# Altium schematic sheet Main.SchDoc
size A3; SheetNumber: 1; SheetTotal: 5
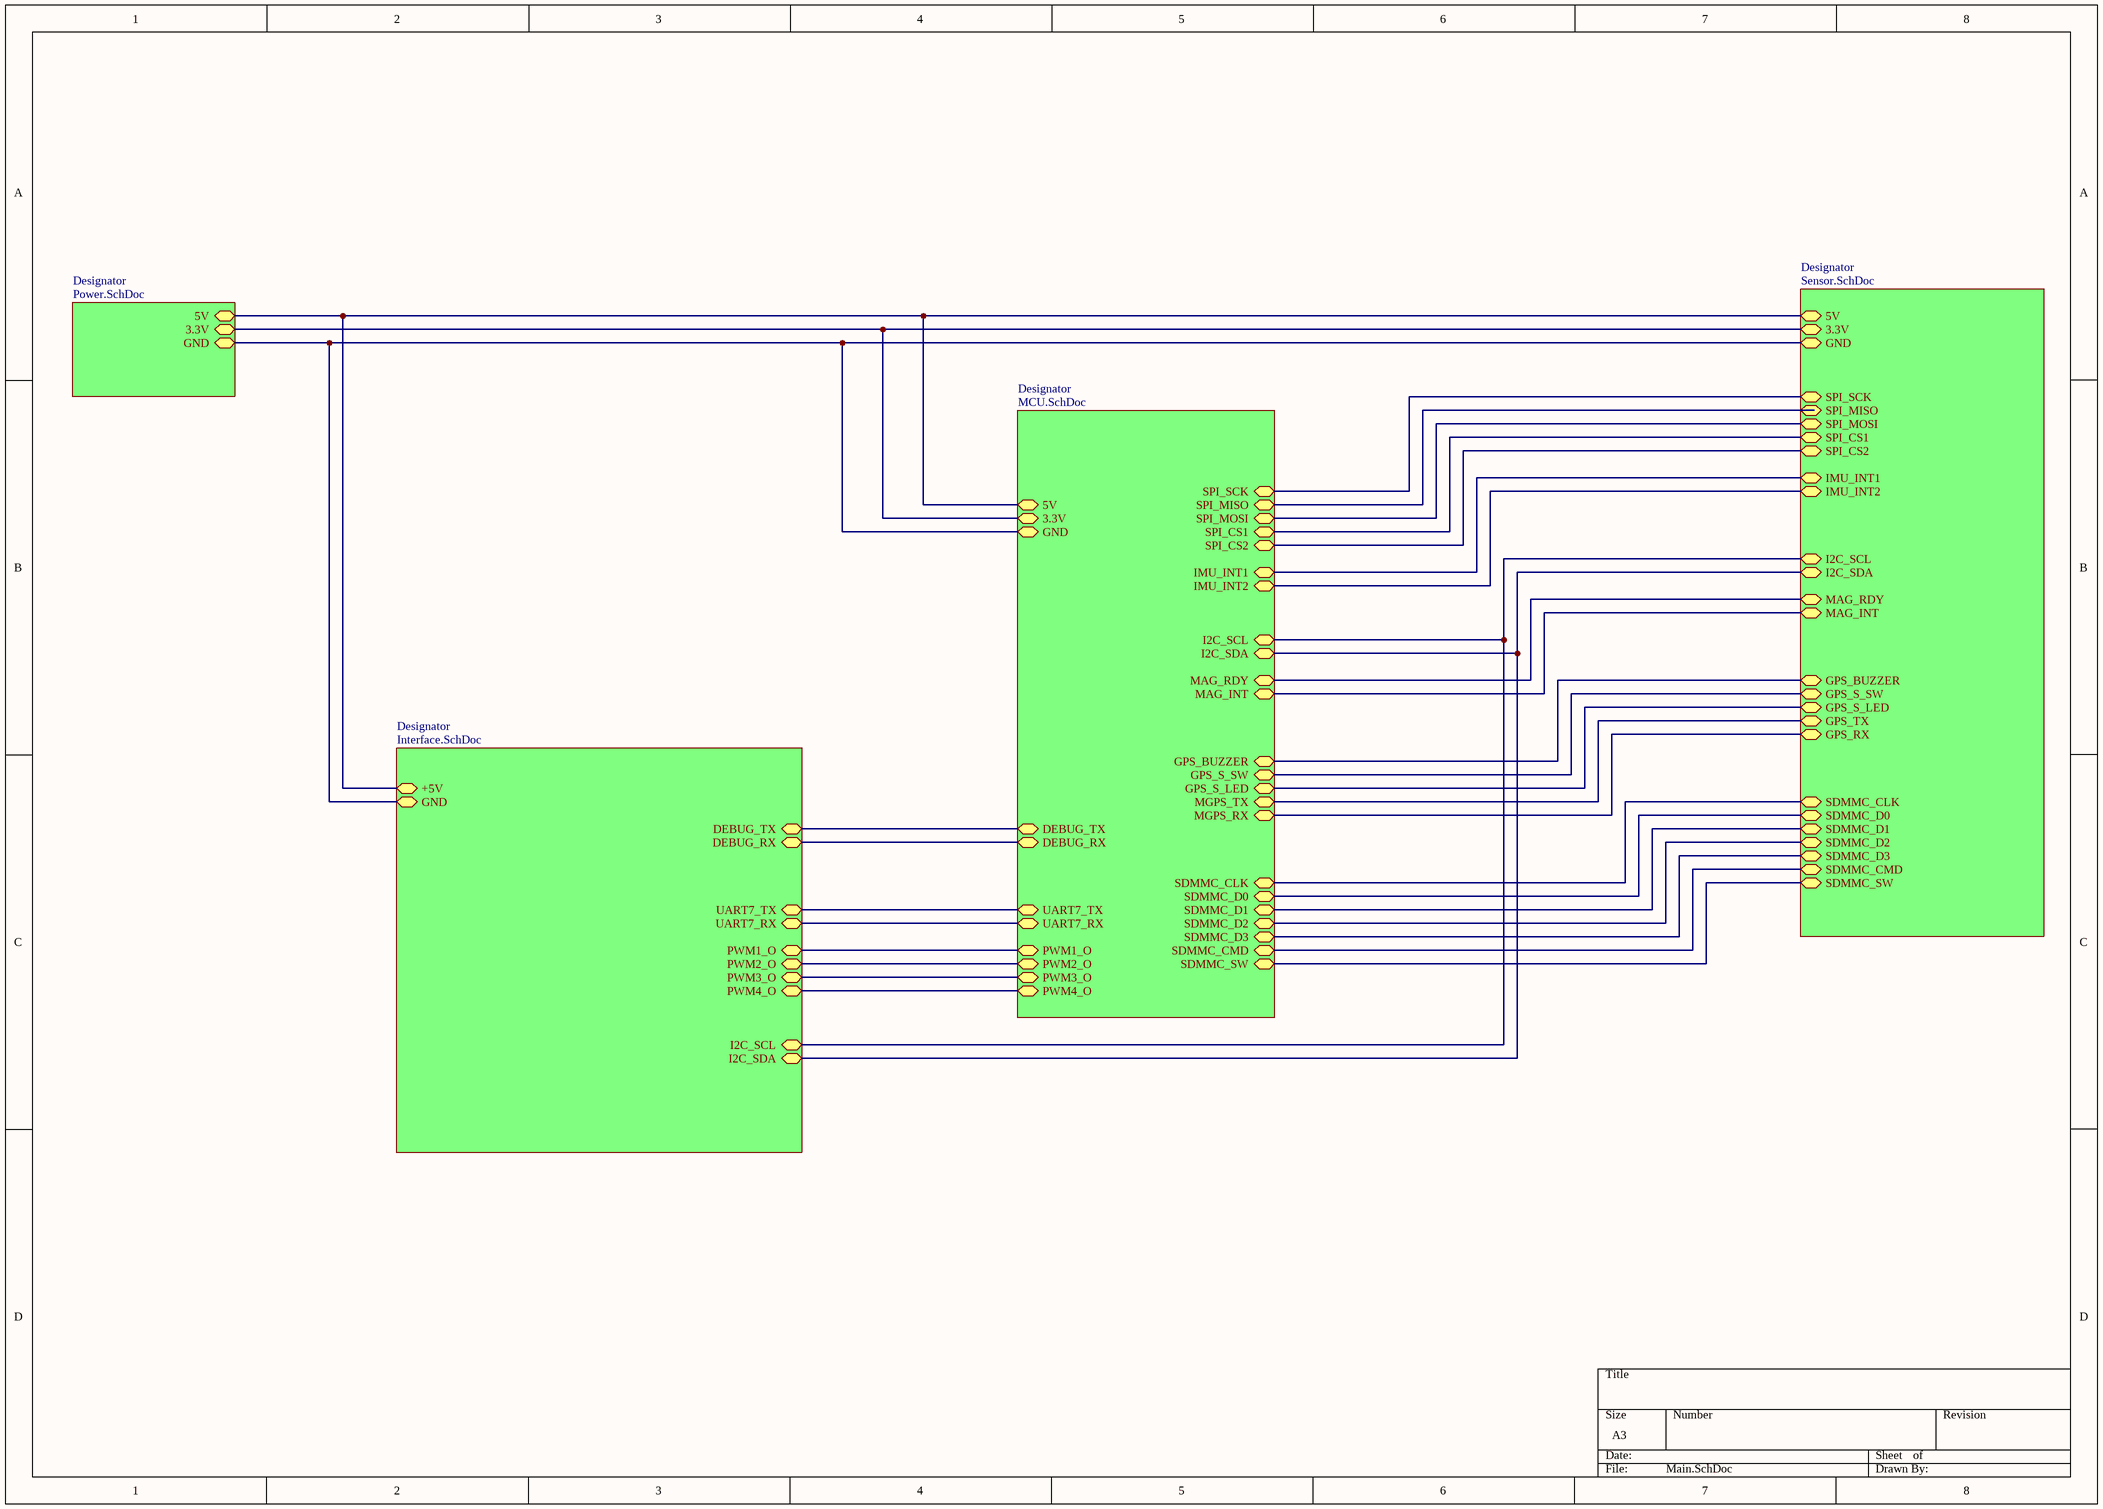
[diagram p0: Main.SchDoc]

## Sub-sheets
Designator = MCU.SchDoc: IMU_INT2 (bidir), MGPS_RX (bidir), MGPS_TX (bidir), MAG_RDY (bidir), MAG_INT (bidir), GND (bidir), 3.3V (bidir), 5V (bidir), SPI_CS1 (bidir), SPI_SCK (bidir), SPI_MISO (bidir), SPI_MOSI (bidir), I2C_SDA (bidir), I2C_SCL (bidir), UART7_RX (bidir), GPS_BUZZER (bidir), UART7_TX (bidir), GPS_S_SW (bidir), DEBUG_TX (bidir), DEBUG_RX (bidir), SPI_CS2 (bidir), IMU_INT1 (bidir), GPS_S_LED (bidir), SDMMC_D0 (bidir), SDMMC_D1 (bidir), SDMMC_CLK (bidir), SDMMC_D3 (bidir), SDMMC_D2 (bidir), SDMMC_CMD (bidir), SDMMC_SW (bidir), PWM3_O (bidir), PWM4_O (bidir), PWM1_O (bidir), PWM2_O (bidir)
Designator = Power.SchDoc: GND (bidir), 3.3V (bidir), 5V (bidir)
Designator = Sensor.SchDoc: MAG_INT (bidir), SPI_MOSI (bidir), SPI_MISO (bidir), IMU_INT2 (bidir), I2C_SCL (bidir), SPI_SCK (bidir), I2C_SDA (bidir), MAG_RDY (bidir), GPS_TX (bidir), GPS_RX (bidir), SPI_CS2 (bidir), 5V (bidir), GND (bidir), 3.3V (bidir), GPS_S_SW (bidir), GPS_S_LED (bidir), GPS_BUZZER (bidir), SDMMC_CLK (bidir), SDMMC_D0 (bidir), SDMMC_D1 (bidir), SDMMC_D2 (bidir), SDMMC_D3 (bidir), SDMMC_CMD (bidir), SDMMC_SW (bidir), SPI_CS1 (bidir), IMU_INT1 (bidir)
Designator = Interface.SchDoc: GND (bidir), DEBUG_TX (bidir), DEBUG_RX (bidir), UART7_TX (bidir), UART7_RX (bidir), I2C_SDA (bidir), I2C_SCL (bidir), PWM1_O (bidir), PWM2_O (bidir), PWM3_O (bidir), PWM4_O (bidir), +5V (bidir)

## Nets
(unnamed): sheet Designator/IMU_INT2, sheet Designator/IMU_INT2
(unnamed): sheet Designator/MGPS_RX, sheet Designator/GPS_RX
(unnamed): sheet Designator/MGPS_TX, sheet Designator/GPS_TX
(unnamed): sheet Designator/MAG_RDY, sheet Designator/MAG_RDY
(unnamed): sheet Designator/MAG_INT, sheet Designator/MAG_INT
(unnamed): sheet Designator/GND, sheet Designator/GND, sheet Designator/GND, sheet Designator/GND
(unnamed): sheet Designator/3.3V, sheet Designator/3.3V, sheet Designator/3.3V
(unnamed): sheet Designator/5V, sheet Designator/5V, sheet Designator/5V, sheet Designator/+5V
(unnamed): sheet Designator/SPI_CS1, sheet Designator/SPI_CS1
(unnamed): sheet Designator/SPI_SCK, sheet Designator/SPI_SCK
(unnamed): sheet Designator/SPI_MISO, sheet Designator/SPI_MISO
(unnamed): sheet Designator/SPI_MOSI, sheet Designator/SPI_MOSI
(unnamed): sheet Designator/I2C_SDA, sheet Designator/I2C_SDA, sheet Designator/I2C_SDA
(unnamed): sheet Designator/I2C_SCL, sheet Designator/I2C_SCL, sheet Designator/I2C_SCL
(unnamed): sheet Designator/UART7_RX, sheet Designator/UART7_RX
(unnamed): sheet Designator/GPS_BUZZER, sheet Designator/GPS_BUZZER
(unnamed): sheet Designator/UART7_TX, sheet Designator/UART7_TX
(unnamed): sheet Designator/GPS_S_SW, sheet Designator/GPS_S_SW
(unnamed): sheet Designator/DEBUG_TX, sheet Designator/DEBUG_TX
(unnamed): sheet Designator/DEBUG_RX, sheet Designator/DEBUG_RX
(unnamed): sheet Designator/SPI_CS2, sheet Designator/SPI_CS2
(unnamed): sheet Designator/IMU_INT1, sheet Designator/IMU_INT1
(unnamed): sheet Designator/GPS_S_LED, sheet Designator/GPS_S_LED
(unnamed): sheet Designator/SDMMC_D0, sheet Designator/SDMMC_D0
(unnamed): sheet Designator/SDMMC_D1, sheet Designator/SDMMC_D1
(unnamed): sheet Designator/SDMMC_CLK, sheet Designator/SDMMC_CLK
(unnamed): sheet Designator/SDMMC_D3, sheet Designator/SDMMC_D3
(unnamed): sheet Designator/SDMMC_D2, sheet Designator/SDMMC_D2
(unnamed): sheet Designator/SDMMC_CMD, sheet Designator/SDMMC_CMD
(unnamed): sheet Designator/SDMMC_SW, sheet Designator/SDMMC_SW
(unnamed): sheet Designator/PWM3_O, sheet Designator/PWM3_O
(unnamed): sheet Designator/PWM4_O, sheet Designator/PWM4_O
(unnamed): sheet Designator/PWM1_O, sheet Designator/PWM1_O
(unnamed): sheet Designator/PWM2_O, sheet Designator/PWM2_O